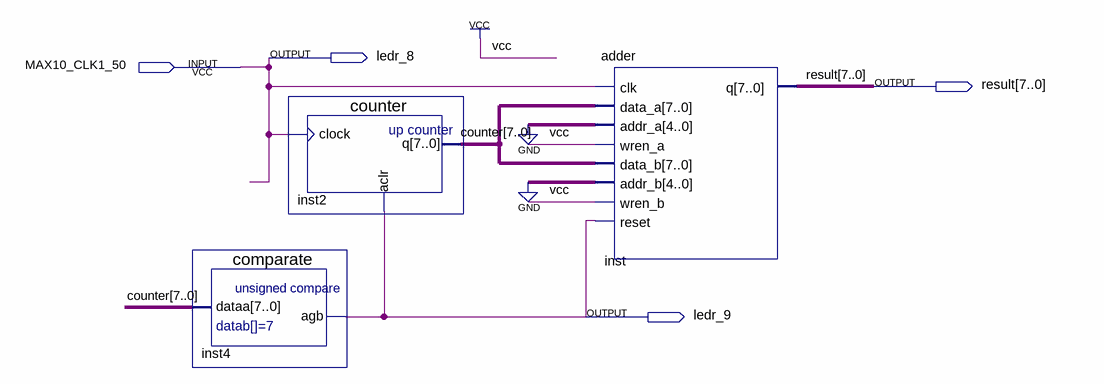
[diagram p0: schematic sheet]
// Quartus schematic for_sh.bdf as structural Verilog: 3 symbols, 4 pins
module for_sh (
  input  MAX10_CLK1_50,
  output ledr_8,
  output [7:0] result,
  output ledr_9
);

  wire [7:0] counter;

  comparate inst4 (.dataa(counter), .agb(ledr_9));
  counter inst2 (.clock(MAX10_CLK1_50), .aclr(ledr_9), .q(counter));
  adder inst (
    .clk(MAX10_CLK1_50), .data_a(counter), .addr_a({5{1'b0}}), .wren_a(1'b1), .data_b(counter),
    .addr_b({5{1'b0}}), .wren_b(1'b1), .reset(ledr_9), .q(result));

  assign ledr_8 = MAX10_CLK1_50;
endmodule
